# EAGLE design rn4020_adapter (EAGLE 7.7.0)
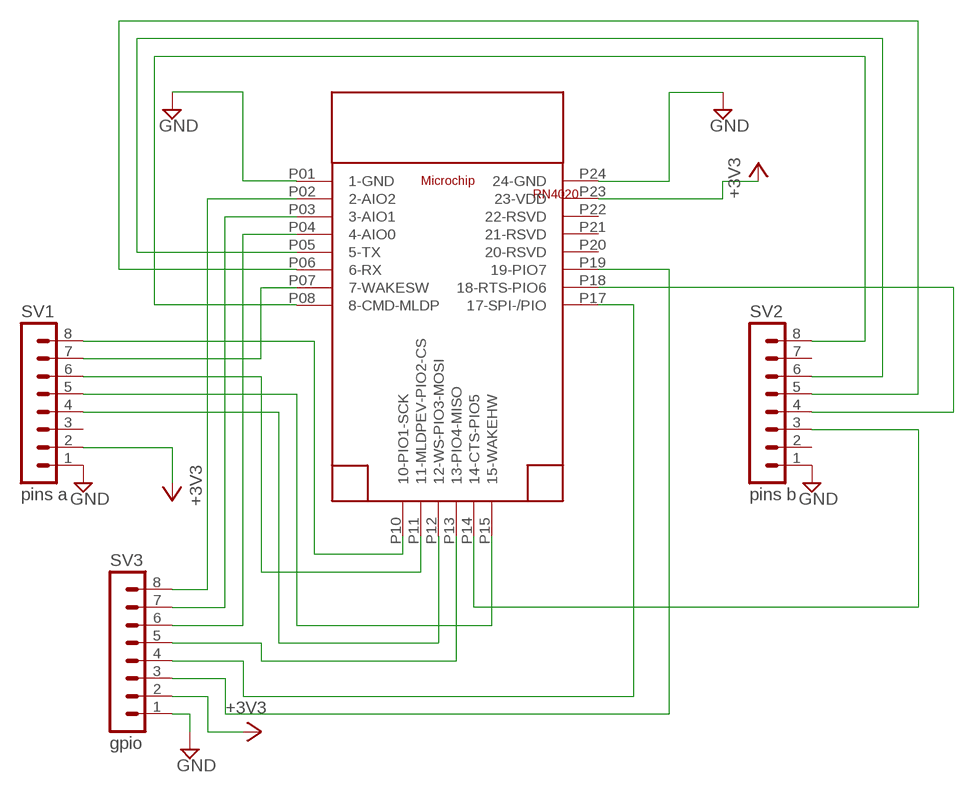
[diagram p0: schematic, sheet 1]

## Parts
SV1  pins a  MA08-1  [MA08-1]
SV2  pins b  MA08-1  [MA08-1]
SV3  gpio  MA08-1  [MA08-1]
U$1  RN4020  [RN4020SMD]

## Nets
+3V3: SV1.2 SV3.2 U$1.P23(23-VDD)
GND: SV1.1 SV2.1 SV3.1 U$1.P01(1-GND) U$1.P24(24-GND)
N$1: SV2.4 U$1.P18(18-RTS-PIO6)
N$2: SV2.3 U$1.P14(14-CTS-PIO5)
N$3: SV1.8 U$1.P10(10-PIO1-SCK)
N$4: SV1.7 U$1.P07(7-WAKESW)
N$5: SV2.8 U$1.P08(8-CMD-MLDP)
N$6: SV2.6 U$1.P05(5-TX)
N$7: SV2.5 U$1.P06(6-RX)
N$8: SV1.5 U$1.P15(15-WAKEHW)
N$9: SV1.4 U$1.P12(12-WS-PIO3-MOSI)
N$10: SV1.6 U$1.P11(11-MLDPEV-PIO2-CS)
N$11: SV3.6 U$1.P04(4-AIO0)
N$12: SV3.7 U$1.P03(3-AIO1)
N$13: SV3.8 U$1.P02(2-AIO2)
N$14: SV3.5 U$1.P13(13-PIO4-MISO)
N$15: SV3.4 U$1.P17(17-SPI-/PIO)
N$16: SV3.3 U$1.P19(19-PIO7)
Unconnected: SV1.3 SV2.2 SV2.7 U$1.P20(20-RSVD) U$1.P21(21-RSVD) U$1.P22(22-RSVD)

## Library data of the parts
SV1-SV3 = con-lstb:MA08-1: PIN HEADER; OC_FARNELL: unknown; OC_NEWARK: unknown
U$1 = microchip_bluetooth_v101:RN4020

## Board
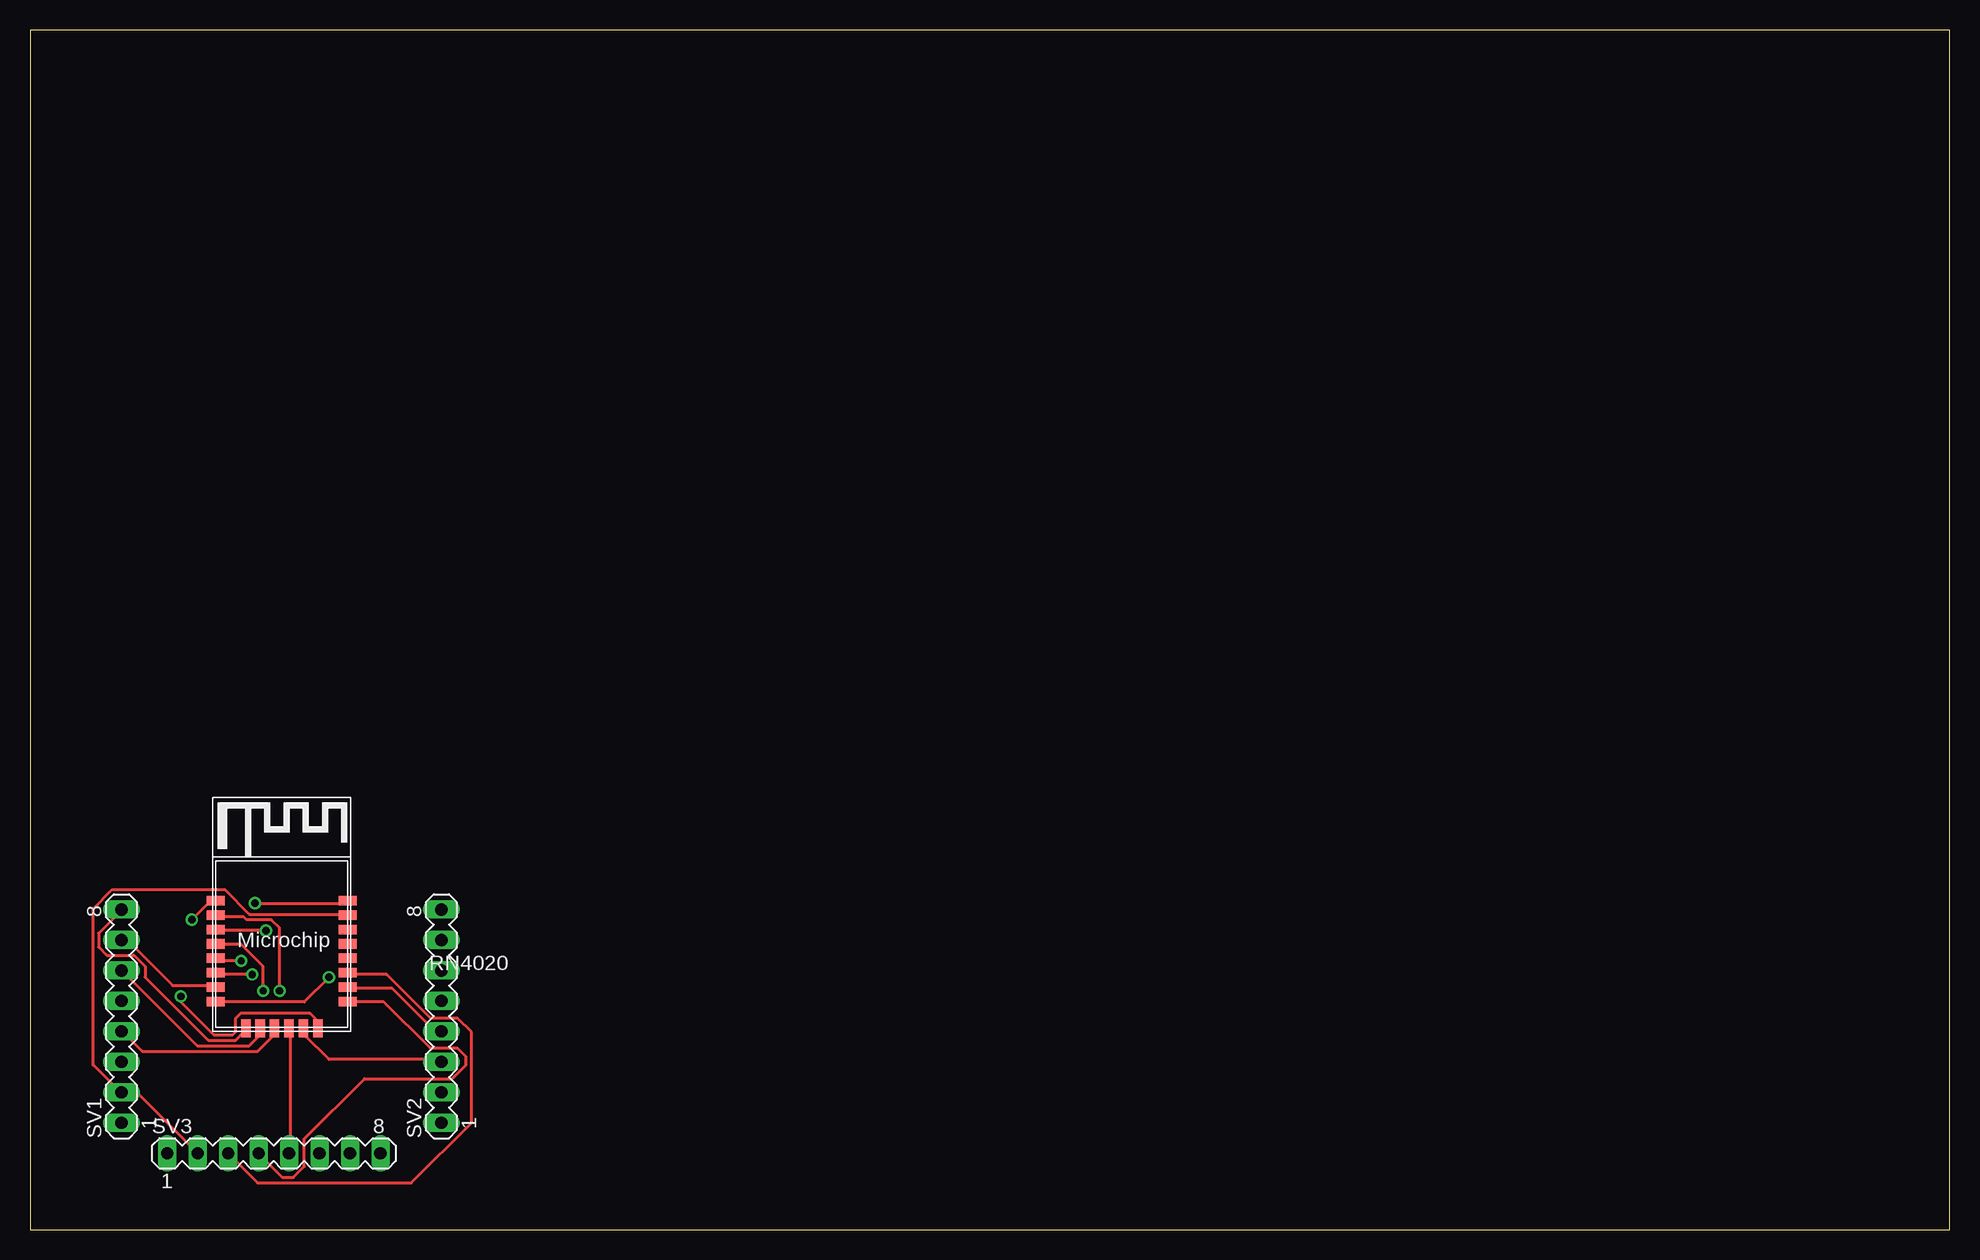
[diagram p1: board, top side]
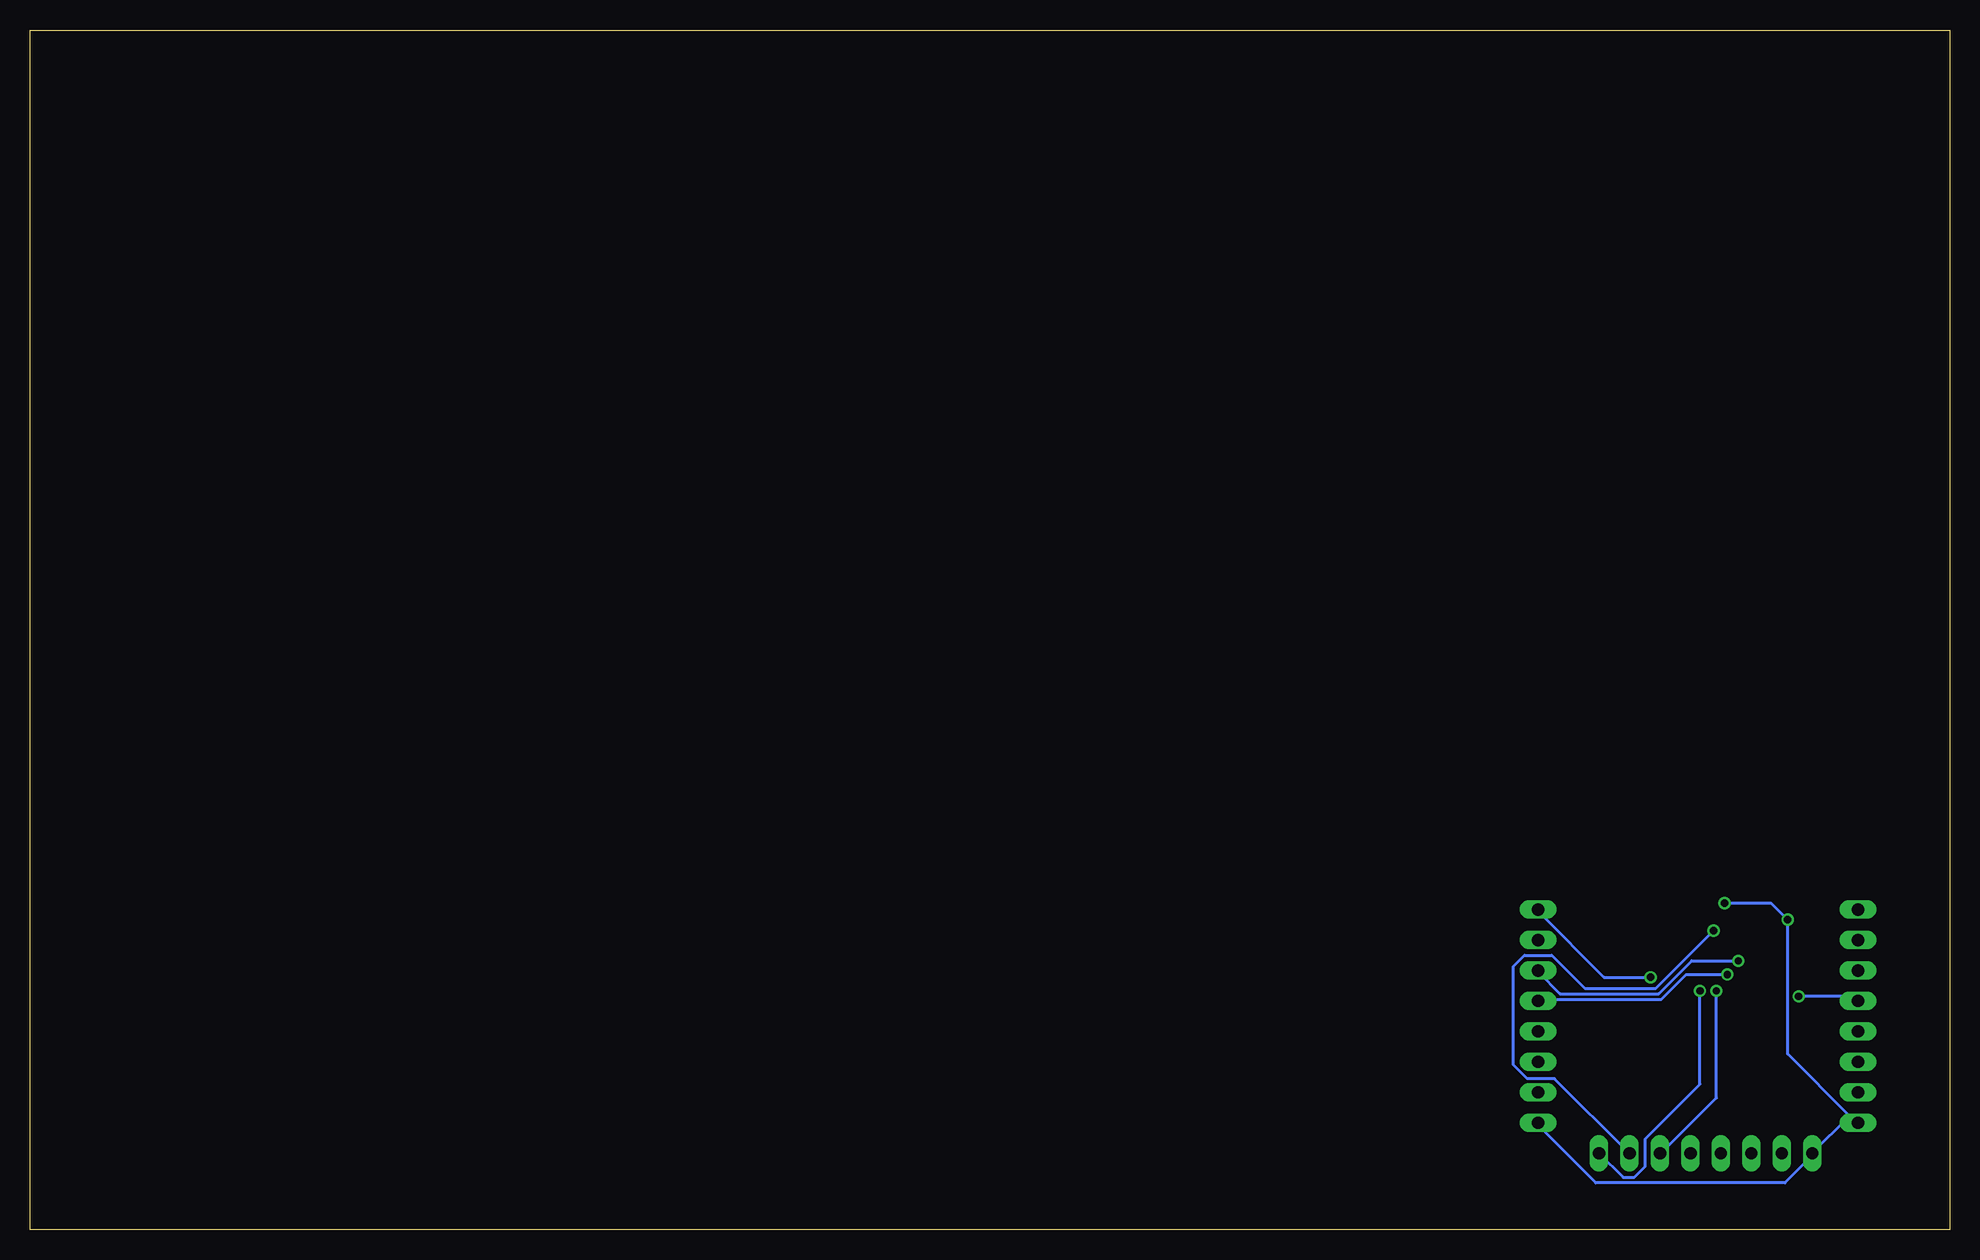
[diagram p2: board, bottom side, seen from below]

Size 160 x 100 mm. Coordinates in mm from the lower left corner, seen from the top.
Outline: 0,0 160,0 160,100 0,100 0,0
Copper layers (1*16): Top 0.035mm / dielectric 1.5mm / Bottom 0.035mm
Design rules "default": minimum track width 10mil, minimum drill 24mil, track to track 8mil, track to pad 8mil, pad to pad 8mil, via to via 8mil, smd to smd 8mil, copper to edge 40mil, drill to drill 8mil, minimum pad ring 10mil, minimum via ring 8mil, stop-mask expansion 4mil, vias tented up to drill 0mil, thermal gap 10mil

### Footprints (pad centres in the part's own frame; a part is rotated, then mirrored left to right if it is on the bottom)
MA08-1 = drill 1.016 long: 1 -8.89,0; 2 -6.35,0; 3 -3.81,0; 4 -1.27,0; 5 1.27,0; 6 3.81,0; 7 6.35,0; 8 8.89,0
RN4020SMD = smd 1.5 x 0.8: P01 0.25,10.9; P02 0.25,9.7; P03 0.25,8.5; P04 0.25,7.3; P05 0.25,6.1; P06 0.25,4.9; P07 0.25,3.7; P08 0.25,2.5; P17 11.25,2.5; P18 11.25,3.7; P19 11.25,4.9; P20 11.25,6.1; P21 11.25,7.3; P22 11.25,8.5; P23 11.25,9.7; P24 11.25,10.9 | smd 0.8 x 1.5: P10 2.75,0.25; P11 3.95,0.25; P12 5.15,0.25; P13 6.35,0.25; P14 7.55,0.25; P15 8.75,0.25

### Placement (x,y rotation side)
SV1  7.62,17.78 90 top
SV2  34.29,17.78 90 top
SV3  20.32,6.35 0 top
U$1  15.24,16.51 0 top

### Tracks (layer width: path | path; a pad name or v marks a point on that pad's centre or on a via)
+3V3
  Top 0.254: U$1.P23 26.29,26.29 18.29,26.29 16.23,28.35 6.86,28.35 5.26,26.75 5.26,13.72 7.54,11.43 SV1.2 8.91,11.43 13.95,6.4 SV3.2
GND  (via drill 0.61)
  Top 0.254: v13.49,25.83 14.86,27.2 15.32,27.2 U$1.P01 | v18.75,27.2 26.29,27.2 U$1.P24
  Bottom 0.254: 8.23,9.37 7.77,8.91 SV1.1 8.23,9.37 | 8.23,9.37 13.49,14.63 v13.49,25.83 14.86,27.2 v18.75,27.2 | 8.23,9.37 8.46,9.37 11.43,6.4 SV3.1 11.43,6.17 13.72,3.89 29.49,3.89 34.29,8.69 SV2.1
N$1
  Top 0.254: U$1.P18 26.52,20.12 30.18,20.12 33.6,16.69 34.29,16.69 SV2.4
N$2
  Top 0.254: U$1.P14 22.86,16.69 22.86,16.23 24.92,14.17 34.29,14.17 SV2.3
N$3
  Top 0.254: U$1.P10 17.83,16.69 17.83,16.46 17.14,15.77 14.86,15.77 9.6,21.03 9.6,21.95 8.69,22.86 6.4,22.86 5.71,23.55 5.71,24.69 7.54,26.52 SV1.8
N$4
  Top 0.254: U$1.P07 15.32,20.34 11.89,20.34 8.23,24 7.77,24 SV1.7
N$5  (via drill 0.61)
  Top 0.254: v24.92,21.03 22.86,18.97 15.54,18.97 U$1.P08
  Bottom 0.254: v24.92,21.03 28.8,21.03 34.29,26.52 SV2.8
N$6  (via drill 0.61)
  Top 0.254: v17.6,22.4 15.54,22.4 U$1.P05
  Bottom 0.254: v17.6,22.4 21.49,22.4 24.23,19.66 32.46,19.66 34.29,21.49 SV2.6
N$7  (via drill 0.61)
  Top 0.254: v18.52,21.26 15.54,21.26 U$1.P06
  Bottom 0.254: v18.52,21.26 21.95,21.26 24,19.2 34.29,19.2 SV2.5
N$8  (via drill 0.61)
  Top 0.254: v12.57,19.43 12.57,18.97 15.32,16.23 16.92,16.23 17.14,16.46 17.14,17.6 17.6,18.06 23.32,18.06 23.77,17.6 23.77,16.92 U$1.P15
  Bottom 0.254: v12.57,19.43 8,19.43 SV1.5
N$9
  Top 0.254: U$1.P12 20.34,16.69 20.34,16.23 18.97,14.86 9.37,14.86 7.77,16.46 SV1.4
N$10
  Top 0.254: U$1.P11 18.97,16.69 18.97,16 18.29,15.32 13.95,15.32 7.77,21.49 SV1.6
N$11  (via drill 0.61)
  Top 0.254: v19.43,19.89 19.43,21.95 17.6,23.77 15.54,23.77 U$1.P04
  Bottom 0.254: v19.43,19.89 19.43,10.97 24,6.4 SV3.6
N$12  (via drill 0.61)
  Top 0.254: v19.66,24.92 15.54,24.92 U$1.P03
  Bottom 0.254: v19.66,24.92 24.46,20.12 30.4,20.12 33.15,22.86 35.43,22.86 36.35,21.95 36.35,13.72 35.2,12.57 32.92,12.57 26.75,6.4 SV3.7
N$13  (via drill 0.61)
  Top 0.254: v20.8,19.89 20.8,25.15 20.12,25.83 18.06,25.83 17.83,26.06 15.54,26.06 U$1.P02
  Bottom 0.254: v20.8,19.89 20.8,12.12 25.38,7.54 25.38,5.26 26.29,4.34 27.2,4.34 SV3.8
N$14
  Top 0.254: U$1.P13 21.72,16.69 21.72,6.4 SV3.5
N$15
  Top 0.254: U$1.P17 26.52,18.97 29.49,18.97 33.38,15.09 35.66,15.09 36.35,14.4 36.35,13.72 35.2,12.57 27.89,12.57 22.86,7.54 22.86,5.26 21.95,4.34 21.03,4.34 19.2,6.17 SV3.4
N$16
  Top 0.254: SV3.3 18.97,3.89 31.77,3.89 36.8,8.91 36.8,16.46 35.66,17.6 33.38,17.6 29.72,21.26 26.52,21.26 U$1.P19